# Altium schematic sheet lights.SchDoc: X
size A4; Date: DD-MM-YYYY; CheckedBy: X; DrawnBy: Y; Revision: 0.0.0; SheetNumber: X; SheetTotal: Y; Projectnumber: OWN-000; Size: A4; Projectname: X
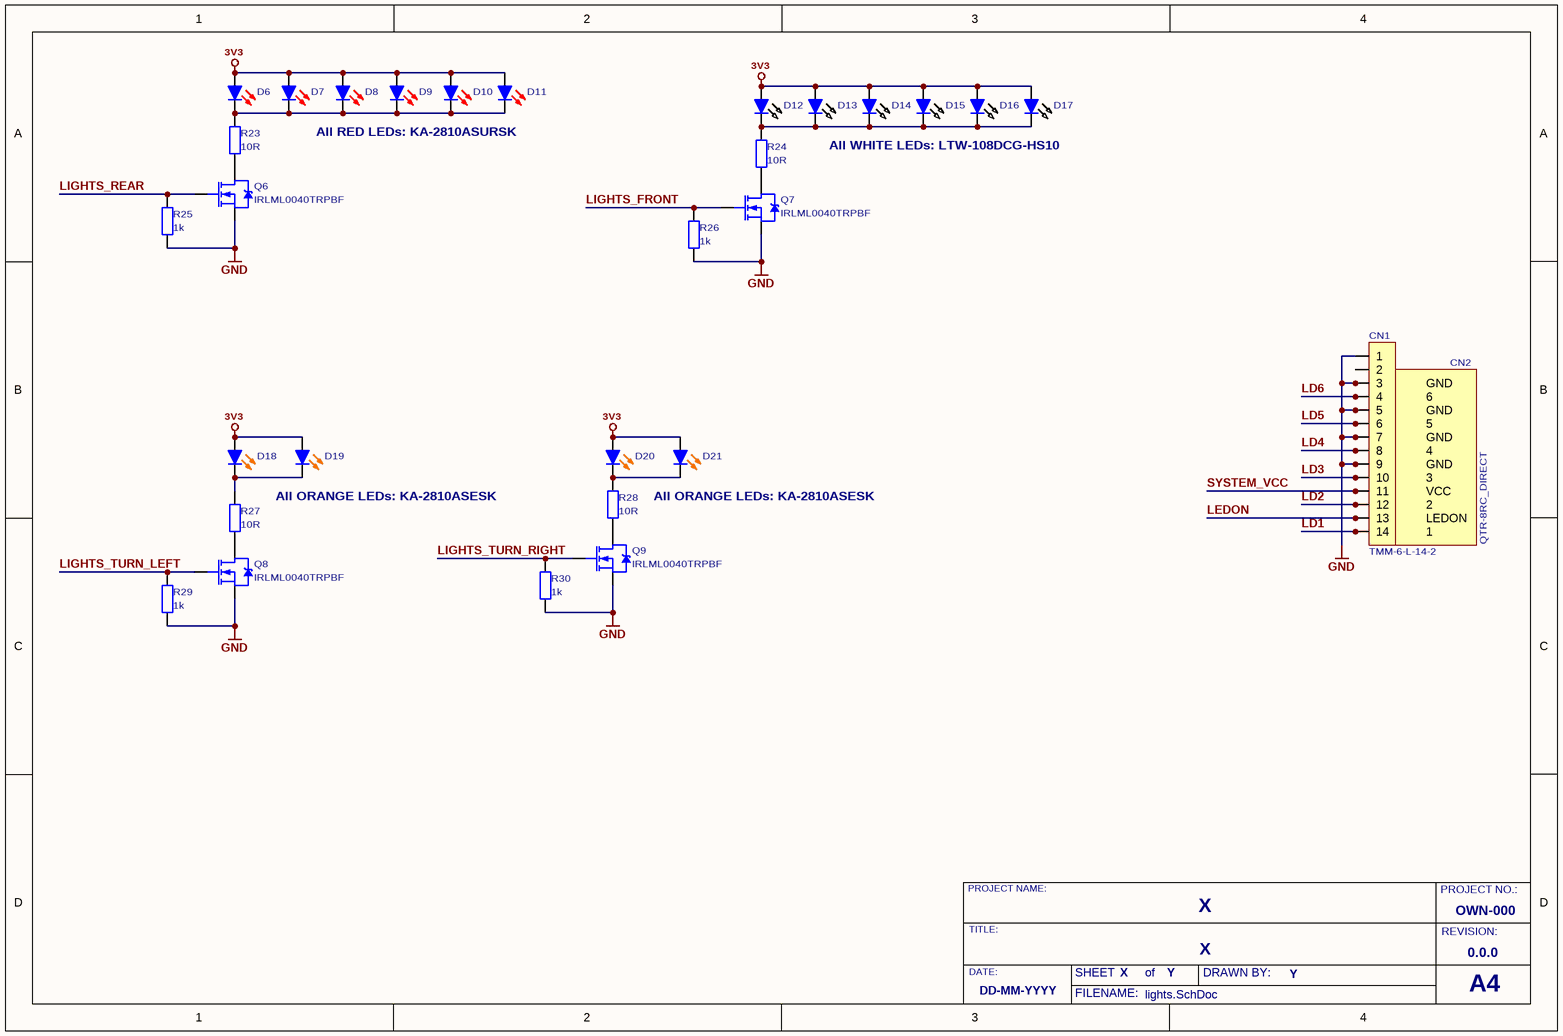
[diagram p0: lights.SchDoc]

## Parts
CN1  TMM-6-L-14-2  [MM_14_SMD_LCK]
CN2  QTR-8RC_DIRECT  [QTR-8RC_SNAPPED_GOLDPIN_VERTICAL]
D6  KA-2810ASURSK  [LED2810]  (value not drawn)
D7  KA-2810ASURSK  [LED2810]  (value not drawn)
D8  KA-2810ASURSK  [LED2810]  (value not drawn)
D9  KA-2810ASURSK  [LED2810]  (value not drawn)
D10  KA-2810ASURSK  [LED2810]  (value not drawn)
D11  KA-2810ASURSK  [LED2810]  (value not drawn)
D12  LTW-108DCG-HS10  [LED2810]  (value not drawn)
D13  LTW-108DCG-HS10  [LED2810]  (value not drawn)
D14  LTW-108DCG-HS10  [LED2810]  (value not drawn)
D15  LTW-108DCG-HS10  [LED2810]  (value not drawn)
D16  LTW-108DCG-HS10  [LED2810]  (value not drawn)
D17  LTW-108DCG-HS10  [LED2810]  (value not drawn)
D18  KA-2810ASESK  [LED2810]  (value not drawn)
D19  KA-2810ASESK  [LED2810]  (value not drawn)
D20  KA-2810ASESK  [LED2810]  (value not drawn)
D21  KA-2810ASESK  [LED2810]  (value not drawn)
Q6  IRLML0040TRPBF  [SOT-23]
Q7  IRLML0040TRPBF  [SOT-23]
Q8  IRLML0040TRPBF  [SOT-23]
Q9  IRLML0040TRPBF  [SOT-23]
R23  10R  [R0805]
R24  10R  [R0805]
R25  1k  [R0805]
R26  1k  [R0805]
R27  10R  [R0805]
R28  10R  [R0805]
R29  1k  [R0805]
R30  1k  [R0805]

## Nets
3V3: D6.2(A) D7.2(A) D8.2(A) D9.2(A) D10.2(A) D11.2(A) D12.2(A) D13.2(A) D14.2(A) D15.2(A) D16.2(A) D17.2(A) D18.2(A) D19.2(A) D20.2(A) D21.2(A)
GND: CN1.1 CN1.3 CN1.5 CN1.7 CN1.9 CN2.GND Q6.2(S) Q7.2(S) Q8.2(S) Q9.2(S) R25.2 R26.2 R29.2 R30.2
LD1: CN1.14 CN2.1
LD2: CN1.12 CN2.2
LD3: CN1.10 CN2.3
LD4: CN1.8 CN2.4
LD5: CN1.6 CN2.5
LD6: CN1.4 CN2.6
LEDON: CN1.13 CN2.LEDON
LIGHTS_FRONT: Q7.1(G) R26.1
LIGHTS_REAR: Q6.1(G) R25.1
LIGHTS_TURN_LEFT: Q8.1(G) R29.1
LIGHTS_TURN_RIGHT: Q9.1(G) R30.1
SYSTEM_VCC: CN1.11 CN2.VCC
NetD6_1: D6.1(K) D7.1(K) D8.1(K) D9.1(K) D10.1(K) D11.1(K) R23.1
NetD12_1: D12.1(K) D13.1(K) D14.1(K) D15.1(K) D16.1(K) D17.1(K) R24.1
NetD18_1: D18.1(K) D19.1(K) R27.1
NetD20_1: D20.1(K) D21.1(K) R28.1
NetQ6_3: Q6.3(D) R23.2
NetQ7_3: Q7.3(D) R24.2
NetQ8_3: Q8.3(D) R27.2
NetQ9_3: Q9.3(D) R28.2

Not connected (* = marked no-connect by the designer): CN1 2

## Notes on the sheet
- All RED LEDs: KA-2810ASURSK
- All WHITE LEDs: LTW-108DCG-HS10
- All ORANGE LEDs: KA-2810ASESK
- PROJECT NAME:
- PROJECT NO.:
- DATE:
- TITLE:
- SHEET
- of
- DRAWN BY:
- REVISION:
- FILENAME:
- A4

## Library data of the parts
CN1 = TMM-6-L-14-2: 14-pin MicroMarch Female Socket With Locking Mechanism, Vertical, SMD
CN2 = QTR-8RC_DIRECT: QTR-8RC Reflectance Sensor Array (Pololu item No. 961); Published: 14-Sep-2006
Q6-Q9 = IRLML0040TRPBF: N-Channel; 40V, 3.6A, 1,25W; HEXFET Power MOS-FET; Supplier 1: Farnell; Supplier 2: TME; Supplier 3: Farnell; Supplier 4: Farnell; Supplier Part Number 1: 1831088RL; Supplier Part Number 2: IRLML0040TRPBF; Supplier Part Number 3: 1829136; Supplier Part Number 4: 1831088
R23-R30 = Res: Resistor; Published: 19-Feb-2006; ComponentLink1Description: datasheet; ComponentLink2Description: supplier
  R23 R24 R27 R28: Value: 10R
  R25 R26 R29 R30: Value: 1k
D6-D11 = KA-2810ASURSK: Published: 04-Apr-2006
D12-D17 = LTW-108DCG-HS10: Published: 04-Apr-2006
D18-D21 = KA-2810ASESK: Published: 04-Apr-2006